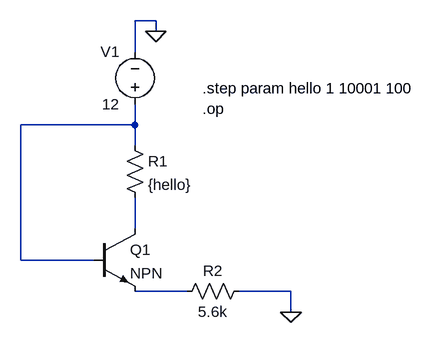
[diagram p0: schematic a1-1e.asc]
a1-1e.asc, the LTspice schematic file:
Version 4
SHEET 1 880 680
WIRE 176 -304 144 -304
WIRE 176 -288 176 -304
WIRE 144 -256 144 -304
WIRE 144 -144 144 -176
WIRE 144 -144 -32 -144
WIRE 144 -112 144 -144
WIRE 144 16 144 -32
WIRE -32 64 -32 -144
WIRE 80 64 -32 64
WIRE 224 112 144 112
WIRE 384 112 304 112
WIRE 384 144 384 112
FLAG 176 -288 0
FLAG 384 144 0
SYMBOL voltage 144 -160 R180
WINDOW 0 24 96 Left 2
WINDOW 3 24 16 Left 2
WINDOW 123 0 0 Left 0
WINDOW 39 0 0 Left 0
SYMATTR InstName V1
SYMATTR Value 12
SYMBOL res 128 -128 R0
SYMATTR InstName R1
SYMATTR Value {hello}
SYMBOL res 320 96 R90
WINDOW 0 0 56 VBottom 2
WINDOW 3 32 56 VTop 2
SYMATTR InstName R2
SYMATTR Value 5.6k
SYMBOL npn 80 16 R0
SYMATTR InstName Q1
TEXT 248 -200 Left 2 !.step param hello 1 10001 100\n.op

The netlist it stands for:
* a1-1e.asc
V1 N001 0 12
R1 N001 N002 {hello}
R2 0 N003 5.6k
Q1 N002 N001 N003 0 NPN
.model NPN NPN
.model PNP PNP
.lib standard.bjt
.step param hello 1 10001 100
.op
.backanno
.end